# EAGLE design LED Light Control (EAGLE 9.5.2)
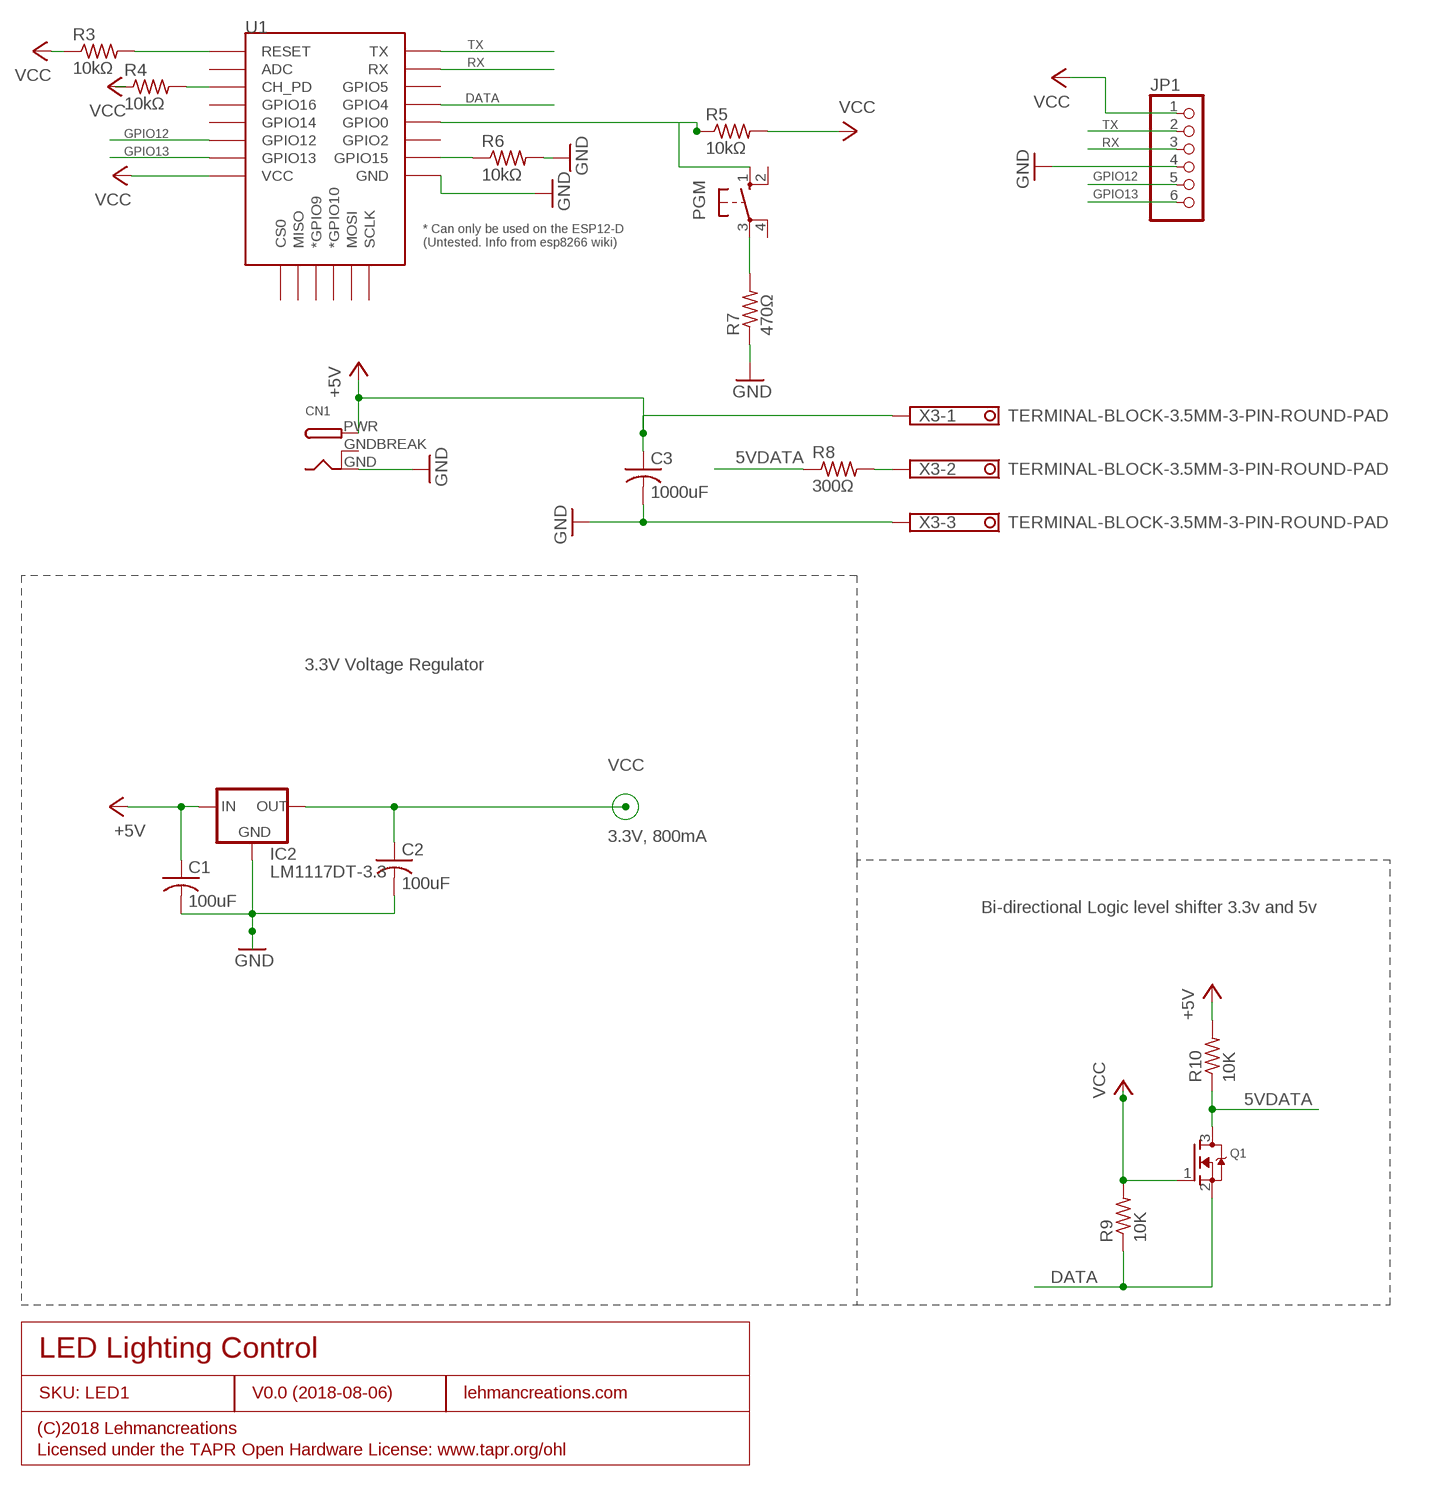
[diagram p0: schematic, sheet 1]

## Parts
C1  100uF  C-USC0805  [C0805]
C2  100uF  C-USC0805  [C0805]
C3  1000uF  C-USC0805  [C0805]
CN1  DCBARRELPTH  [DCJACK_2MM_PTH]
IC2  LM1117DT-3.3  [TO252]
JP1  PINHD-1X6  [1X06]
PGM  10-XX  [B3F-10XX]
Q1  MOSFET-NWAVE  [SOT23-W]
R3  10kΩ  R-US_R0805  [R0805]
R4  10kΩ  R-US_R0805  [R0805]
R5  10kΩ  R-US_R0805  [R0805]
R6  10kΩ  R-US_R0805  [R0805]
R7  470Ω  R-US_R0805  [R0805]
R8  300Ω  R-US_R0805  [R0805]
R9  10K  R-US_R0805  [R0805]
R10  10K  R-US_R0805  [R0805]
U1  ESP12ESMD  [ESP12E-SMD]
X3  TERMINAL-BLOCK-3.5MM-3-PIN-ROUND-PAD  [TERMINAL-BLOCK-3-PIN-3.5MM-ROUND-PAD]

## Nets
5VDATA: Q1.3(D) R8.1 R10.1
+5V: C1.1 C3.1 CN1.PWR IC2.2(IN) R10.2 X3.1
DATA: Q1.2(S) R9.1 U1.GPIO4
GND: C1.2 C2.2 C3.2 CN1.GND IC2.1(GND) JP1.4 R6.2 R7.1 U1.GND X3.3
GPIO0: PGM.1(S) R5.1 U1.GPIO0
GPIO12: JP1.5 U1.GPIO12
GPIO13: JP1.6 U1.GPIO13
N$2: R3.2 U1.RESET
N$3: R4.2 U1.CH_PD
N$5: R6.1 U1.GPIO15
N$6: PGM.3(P) R7.2
N$7: R8.2 X3.2
RX: JP1.3 U1.RXD0(RX)
TX: JP1.2 U1.TXD0(TX)
VCC: C2.1 IC2.3(OUT) JP1.1 Q1.1(G) R3.1 R4.1 R5.2 R9.2 U1.VCC
Unconnected: PGM.2(S1) PGM.4(P1) U1.ADC U1.CS0 U1.GPIO2 U1.GPIO5 U1.GPIO9(*GPIO9) U1.GPIO10(*GPIO10) U1.GPIO14 U1.GPIO16 U1.MISO U1.MOSI U1.SCLK

## Notes on the sheet
- 3.3V Voltage Regulator
- 3.3V, 800mA
- Bi-directional Logic level shifter 3.3v and 5v
- LED Lighting Control
- SKU: LED1 | V0.0 (2018-08-06) | lehmancreations.com
- (C)2018 Lehmancreations
- Licensed under the TAPR Open Hardware License: www.tapr.org/ohl

## Power pins joined to a net without a drawn wire
GNDBREAK: CN1.GNDBREAK

## Library data of the parts
C1-C3 = adafruit:C-US: CAPACITOR, American symbol
CN1 = adafruit:DCBARREL: 2.0mm DC Barrel Jack DCJACK_2MM_PTH - Through Hole Jack (4UConnector: 05537)
IC2 = lm1117:LM1117?-*: 800mA Low-Dropout Linear Regulator Source: http://ww1.microchip.com/downloads/en/DeviceDoc/39760d.pdf; MF: Texas Instruments; MPN: LM1117DT-3.3; OC_FARNELL: 1469048; OC_NEWARK: 41K3430
JP1 = adafruit:PINHD-1X6: PIN HEADER
PGM = switch-omron:10-XX: OMRON SWITCH; MPN: B3F-1000; OC_FARNELL: 176432; OC_NEWARK: 36M3542
Q1 = adafruit:MOSFET-N: N-Channel Mosfet 2N7002E - 60V 260mA SOT23 [Digikey: 2N7002ET1GOSTR-ND] - REEL BSH103 - 30V 850mA SOT23 [Digikey: 568-5013-1-ND]
R3-R10 = adafruit:R-US_: RESISTOR, American symbol
U1 = esp8266modules:ESP12E: ESP12E Module
X3 = Rembrandt Electronics - Terminal Block 3-5mm v1-0:TERMINAL-BLOCK-3.5MM-3-PIN: Terminal Block 3.5mm Pitch: 3,5 mm Number of pins: 3 Created by Rembrandt Electronics www.rembrandtelectronics.com

## Board
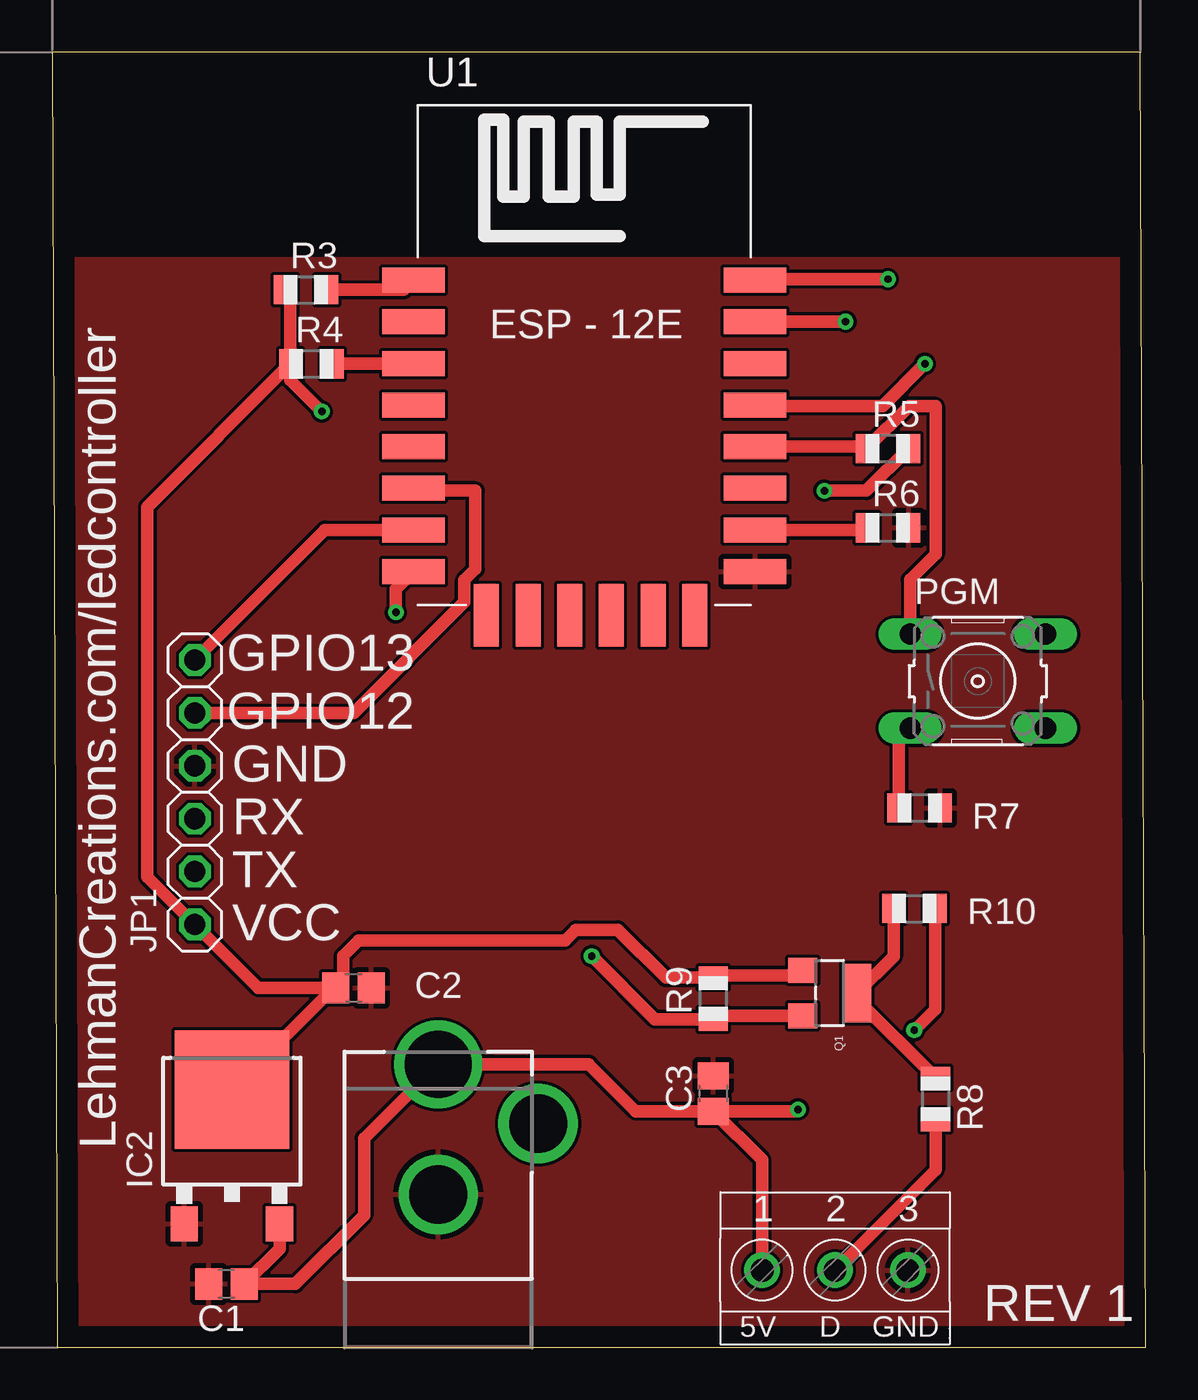
[diagram p1: board, top side]
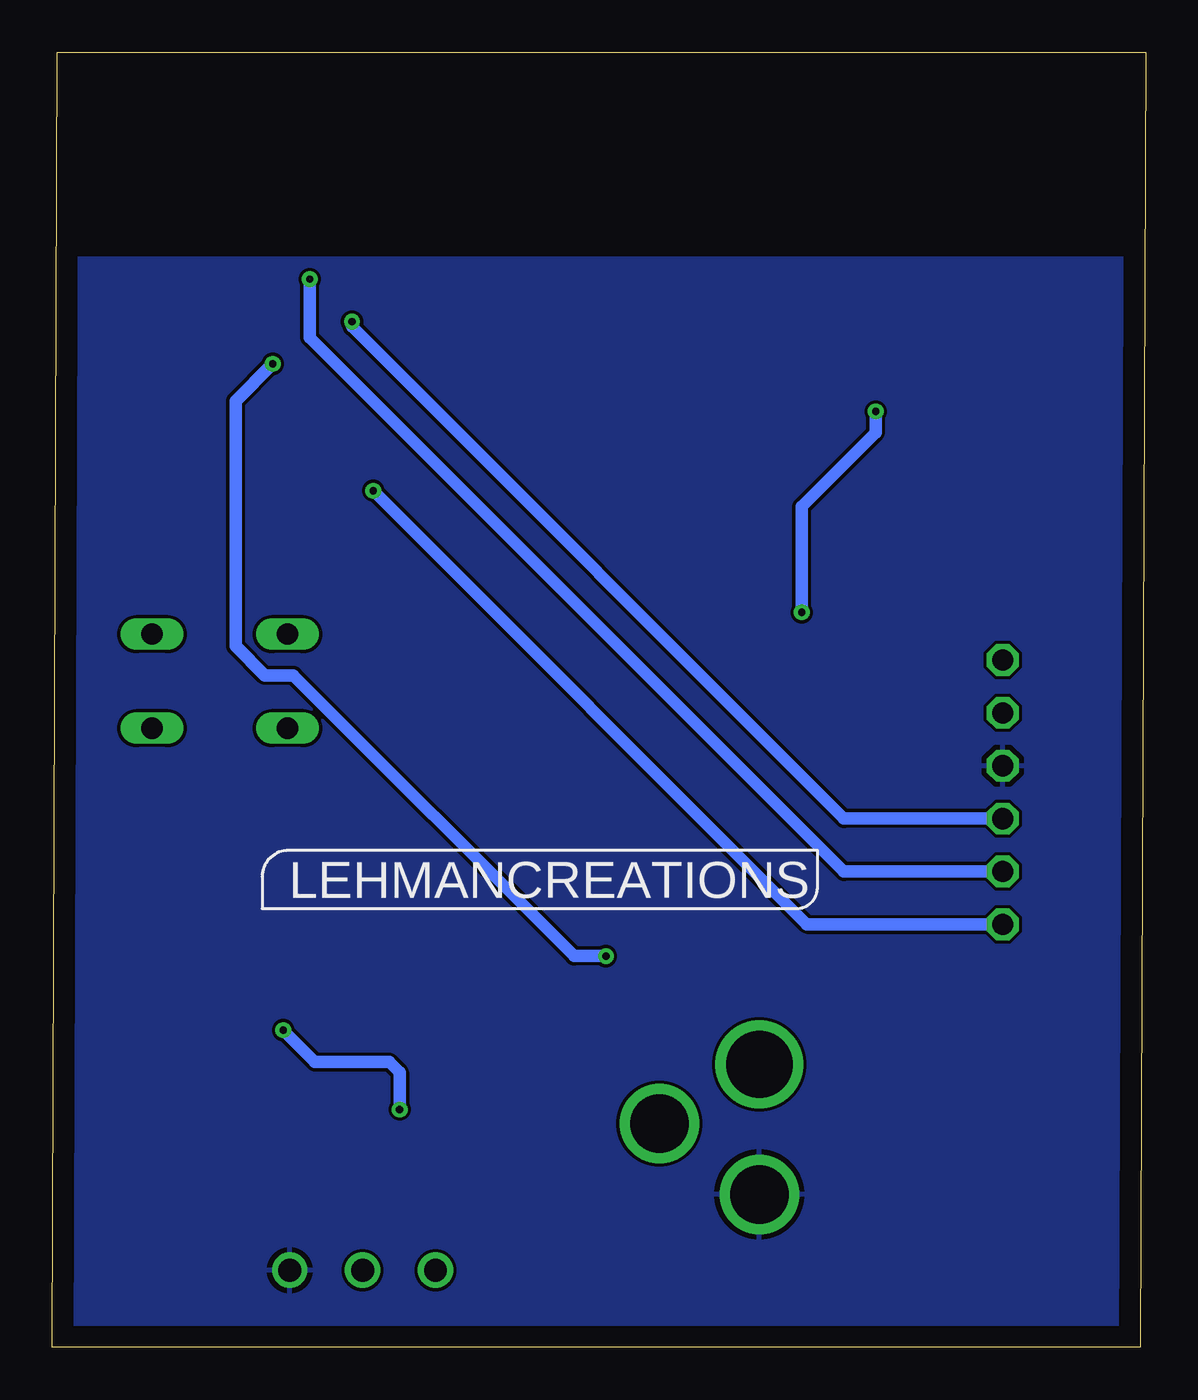
[diagram p2: board, bottom side, seen from below]

Size 52.5 x 62.22 mm. Coordinates in mm from the lower left corner, seen from the top.
Outline: 0.25,0 52.5,0 52.25,62.22 0,62.22 0.25,0
Copper layers (1*16): Top 0.035mm / dielectric 1.5mm / Bottom 0.035mm
Design rules "default": minimum track width 6mil, minimum drill 0.35mm, track to track 6mil, track to pad 6mil, pad to pad 6mil, via to via 6mil, smd to smd 6mil, copper to edge 40mil, drill to drill 6mil, minimum pad ring 10mil, minimum via ring 8mil, stop-mask expansion 4mil, vias tented up to drill 0mil, thermal gap 10mil

### Footprints (pad centres in the part's own frame; a part is rotated, then mirrored left to right if it is on the bottom)
C0805 = smd 1.3 x 1.5: 1 -0.85,0; 2 0.85,0
DCJACK_2MM_PTH = drill 2.8: GND 0,7.35; GNDBREAK 4.8,10.75 | drill 3.2: PWR 0,13.6
TO252 = smd 1.3 x 1.7: 1 -2.285,-4.22; 2 2.285,-4.22 | smd 5.5 x 5.7: 3 0,2.22
1X06 = drill 1.016 octagon: 1 -6.35,0; 2 -3.81,0; 3 -1.27,0; 4 1.27,0; 5 3.81,0; 6 6.35,0
B3F-10XX = drill 1.016 long: 1 -3.251,2.261; 2 3.251,2.261; 3 -3.251,-2.261; 4 3.251,-2.261
SOT23-W = smd 1.2 x 1.4: 1 -1.1,-1.3; 2 1.1,-1.3 | smd 2.8 x 1.4: 3 0,1.3
R0805 = smd 1.1 x 1.4: 1 -1,0; 2 1,0
ESP12E-SMD = smd 3 x 1.2: ADC -8.3,3.8; CH_PD -8.3,1.8; GND 8.1,-8.2; GPIO0 8.1,-2.2; GPIO2 8.1,-4.2; GPIO4 8.1,-0.2; GPIO5 8.1,1.8; GPIO12 -8.3,-4.2; GPIO13 -8.3,-6.2; GPIO14 -8.3,-2.2; GPIO15 8.1,-6.2; GPIO16 -8.3,-0.2; RESET -8.3,5.8; RXD0 8.1,3.8; TXD0 8.1,5.8; VCC -8.3,-8.2 | smd 1.2 x 3: CS0 -4.8,-10.3; GPIO9 -0.8,-10.3; GPIO10 1.2,-10.3; MISO -2.8,-10.3; MOSI 3.2,-10.3; SCLK 5.2,-10.3
TERMINAL-BLOCK-3-PIN-3.5MM-ROUND-PAD = drill 1.1 pad 1.7: 1 -3.5,-0.1; 2 0,-0.1; 3 3.5,-0.1

### Placement (x,y rotation side)
C1  8.38,3.05 180 top
C2  14.48,17.27 0 top
C3  31.75,12.19 90 top
CN1  18.54,0 0 top
IC2  8.64,10.16 0 top
JP1  6.86,26.67 90 top
PGM  44.45,32 0 top
Q1  37.34,17.02 270 top
R3  12.19,50.8 0 top
R4  12.45,47.24 0 top
R5  40.13,43.18 0 top
R6  40.13,39.37 0 top
R7  41.66,25.91 180 top
R8  42.42,11.94 270 top
R9  31.75,16.76 90 top
R10  41.4,21.08 0 top
U1  25.65,45.47 0 top
X3  37.59,3.81 0 top

### Tracks (layer width: path | path; a pad name or v marks a point on that pad's centre or on a via)
5VDATA
  Top 0.61: R8.1 38.64,16.72 Q1.3 40.4,18.78 R10.1
+5V  (via drill 0.35)
  Top 0.61: X3.1 34.09,9 C3.1 | C3.1 28.03,11.34 25.77,13.6 CN1.PWR 14.99,10.04 14.99,6.35 11.68,3.05 C1.1 10.92,4.74 IC2.2 | R10.2 42.4,16.24 v41.4,15.24 | C3.1 35.73,11.34 v35.81,11.43
  Bottom 0.61: v41.4,15.24 39.88,13.72 36.32,13.72 35.81,13.21 v35.81,11.43
DATA  (via drill 0.35)
  Top 0.61: v25.91,18.8 28.94,15.76 R9.1 31.9,15.92 Q1.2 | U1.GPIO4 33.81,45.21 39.88,45.21 v41.91,47.24
  Bottom 0.61: v25.91,18.8 27.43,18.8 40.92,32.28 42.29,32.28 43.69,33.68 43.69,45.47 v41.91,47.24
GND
  pour Bottom: 0.25,52.32 54.1,52.32 54.1,-1.02 0.25,-1.02
  pour Top: 0.25,52.32 54.1,52.32 54.1,-1.02 0.25,-1.02
GPIO0
  Top 0.61: U1.GPIO0 39.05,43.27 R5.1 | R5.1 | R5.1 41.15,45.21 42.42,45.21 42.42,38.1 41.2,36.88 PGM.1
GPIO12
  Top 0.61: JP1.5 14.48,30.48 19.8,35.8 19.8,36.85 20.32,37.38 20.32,41.15 18.03,41.15 17.78,41.4 17.49,41.4 U1.GPIO12
GPIO13
  Top 0.61: 16.76,39.37 16.87,39.27 | 16.87,39.27 U1.GPIO13 | JP1.6 13.1,39.27 16.87,39.27
N$2
  Top 0.61: R3.2 16.89,50.8 U1.RESET
N$3
  Top 0.61: R4.2 16.51,47.24 16.76,46.99 17.08,46.99 U1.CH_PD
N$5
  Top 0.61: U1.GPIO15 39.03,39.27 R6.1
N$6
  Top 0.61: PGM.3 40.66,29.2 R7.2
N$7
  Top 0.61: R8.2 42.42,8.54 X3.2
RX  (via drill 0.35)
  Top 0.61: v38.1,49.28 33.76,49.28 U1.RXD0
  Bottom 0.61: JP1.3 14.48,25.4 38.1,49.02 v38.1,49.28
TX  (via drill 0.35)  (1 unrouted)
  Top 0.61: v40.13,51.31 33.8,51.31 U1.TXD0
  Bottom 0.61: JP1.2 14.48,22.86 40.13,48.51 v40.13,51.31
VCC  (via drill 0.35)
  Top 0.61: Q1.1 35.78,17.86 31.85,17.86 R9.2 29.46,17.76 27.16,20.07 25.15,20.07 24.64,19.56 14.73,19.56 13.97,18.8 13.97,17.61 C2.1 | C2.1 13.53,17.27 IC2.3 | R4.1 4.57,40.37 4.57,22.61 JP1.1 9.91,17.27 C2.1 | R4.1 11.45,50.55 R3.1 | 16.34,37.27 U1.VCC 16.51,36.42 v16.51,35.31 | v12.95,44.96 11.45,46.47 R4.1 | R5.2 39.1,41.15 v37.08,41.15
  Bottom 0.61: v16.51,35.31 16.51,40.39 12.95,43.94 v12.95,44.96 | v37.08,41.15 16.26,20.32 JP1.1

### Text on the board
tNames: LehmanCreations.com/ledcontroller | GPIO13 | GPIO12 | GND | RX | TX | VCC | 5V | D | GND | REV 1
bNames: LEHMANCREATIONS